# Altium schematic sheet TMP117 Temperature Sensors.SchDoc
size Letter
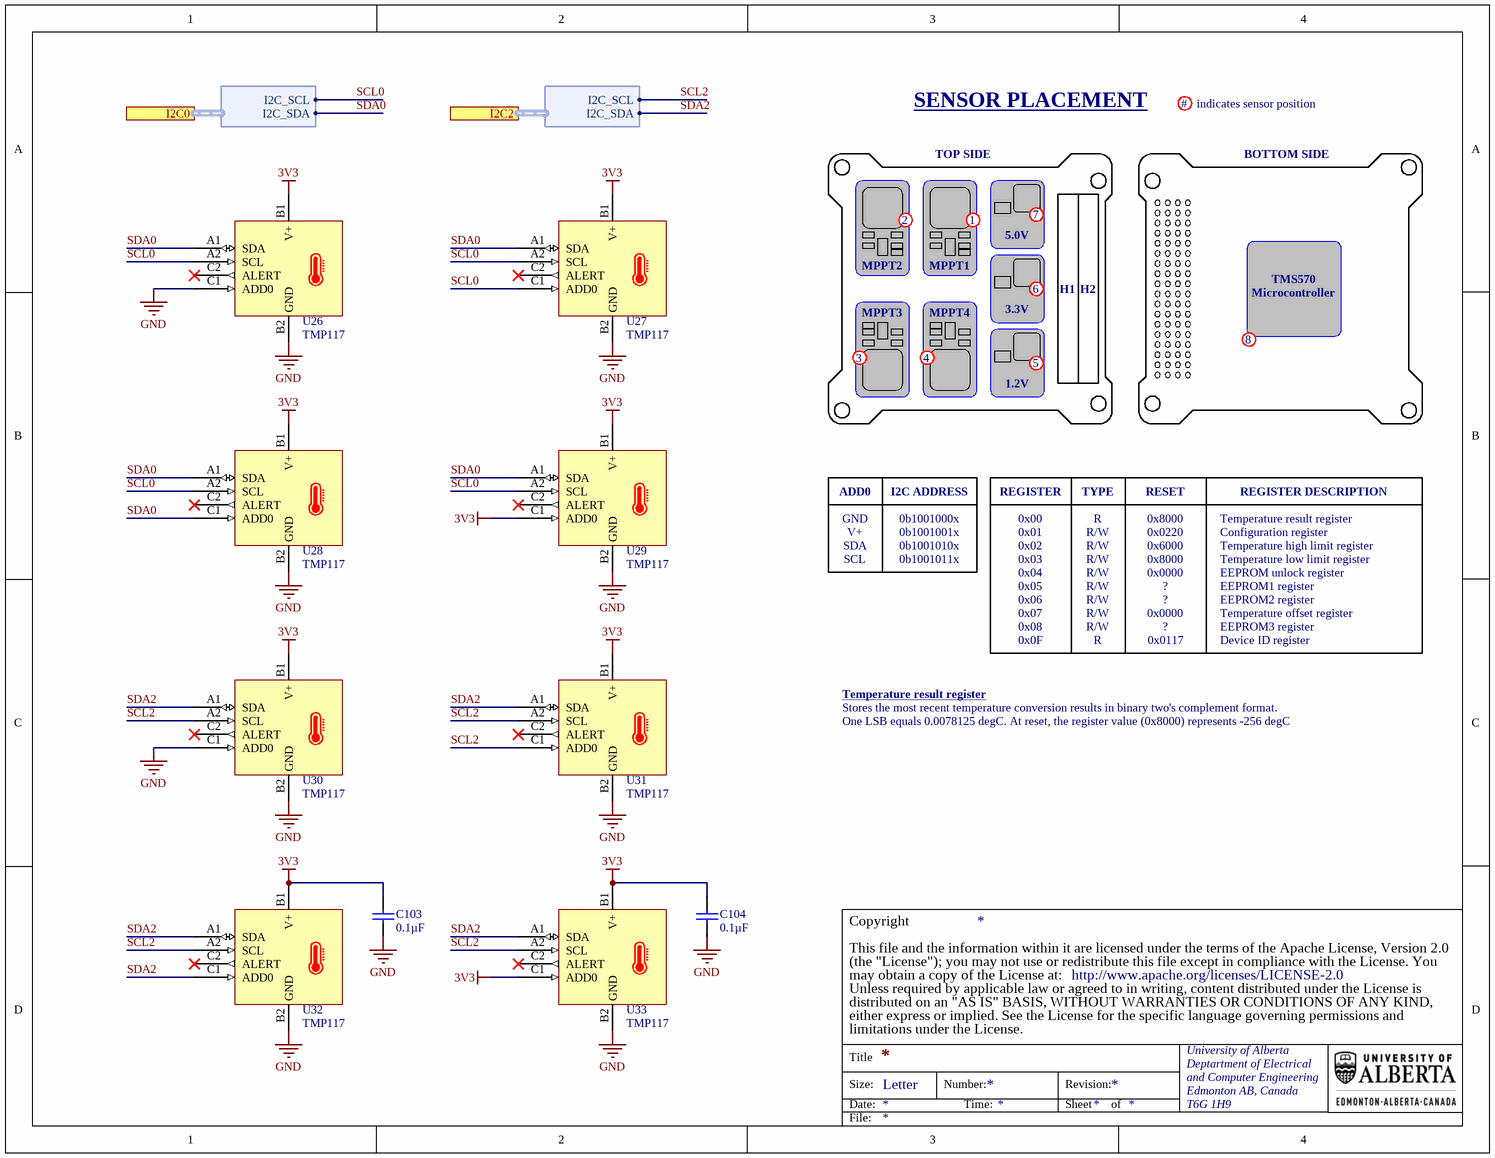
[diagram p0: TMP117 Temperature Sensors.SchDoc]

## Parts
C103  value 0.1µF  [TDK-CGA2B]  (hidden comment: Cap)
C104  value 0.1µF  [TDK-CGA2B]  (hidden comment: Cap)
U26  TMP117  [TI-YBG0006-C01]
U27  TMP117  [TI-YBG0006-C01]
U28  TMP117  [TI-YBG0006-C01]
U29  TMP117  [TI-YBG0006-C01]
U30  TMP117  [TI-YBG0006-C01]
U31  TMP117  [TI-YBG0006-C01]
U32  TMP117  [TI-YBG0006-C01]
U33  TMP117  [TI-YBG0006-C01]

## Ports
I2C0 (harness TCA9548A_I2CIN), I2C2 (harness TCA9548A_I2CIN)

## Harnesses
TCA9548A_I2CIN: I2C_SCL, I2C_SDA

## Nets
3V3: C103.1 C104.1 U26.B1(V+) U27.B1(V+) U28.B1(V+) U29.B1(V+) U29.C1(ADD0) U30.B1(V+) U31.B1(V+) U32.B1(V+) U33.B1(V+) U33.C1(ADD0)
GND: C103.2 C104.2 U26.B2(GND) U26.C1(ADD0) U27.B2(GND) U28.B2(GND) U29.B2(GND) U30.B2(GND) U30.C1(ADD0) U31.B2(GND) U32.B2(GND) U33.B2(GND)
SCL0: U26.A2(SCL) U27.A2(SCL) U27.C1(ADD0) U28.A2(SCL) U29.A2(SCL) ; port I2C0.I2C_SCL
SCL2: U30.A2(SCL) U31.A2(SCL) U31.C1(ADD0) U32.A2(SCL) U33.A2(SCL) ; port I2C2.I2C_SCL
SDA0: U26.A1(SDA) U27.A1(SDA) U28.A1(SDA) U28.C1(ADD0) U29.A1(SDA) ; port I2C0.I2C_SDA
SDA2: U30.A1(SDA) U31.A1(SDA) U32.A1(SDA) U32.C1(ADD0) U33.A1(SDA) ; port I2C2.I2C_SDA

Not connected (* = marked no-connect by the designer): U26 C2(ALERT)*; U27 C2(ALERT)*; U28 C2(ALERT)*; U29 C2(ALERT)*; U30 C2(ALERT)*; U31 C2(ALERT)*; U32 C2(ALERT)*; U33 C2(ALERT)*

## Notes on the sheet
- SENSOR PLACEMENT
- #
- indicates sensor position
- TOP SIDE
- BOTTOM SIDE
- 2
- 1
- 5.0V
- 7
- MPPT2
- MPPT1
- 6
- H1
- H2
- TMS570
- Microcontroller
- 3
- MPPT3
- 4
- MPPT4
- 3.3V
- 5
- 8
- 1.2V
- ADD0
- I2C ADDRESS
- REGISTER
- TYPE
- RESET
- REGISTER DESCRIPTION
- GND
- V+
- SDA
- SCL
- 0b1001000x
- 0b1001001x
- 0b1001010x
- 0b1001011x
- 0x00
- 0x01
- 0x02
- 0x03
- 0x04
- R
- R/W
- 0x8000
- 0x0220
- 0x6000
- 0x0000
- Temperature result register
- Configuration register
- Temperature high limit register
- Temperature low limit register
- EEPROM unlock register
- 0x05
- 0x06
- 0x07
- 0x08
- 0x0F
- ?
- 0x0117
- EEPROM2 register
- EEPROM1 register
- EEPROM3 register
- Temperature offset register
- Device ID register
- Stores the most recent temperature conversion results in binary two's complement format.
- One LSB equals 0.0078125 degC. At reset, the register value (0x8000) represents -256 degC
- (the "License"); you may not use or redistribute this file except in compliance with the License. You
- This file and the information within it are licensed under the terms of the Apache License, Version 2.0
- Copyright
- Unless required by applicable law or agreed to in writing, content distributed under the License is
- distributed on an "AS IS" BASIS, WITHOUT WARRANTIES OR CONDITIONS OF ANY KIND,
- either express or implied. See the License for the specific language governing permissions and
- limitations under the License.
- may obtain a copy of the License at:
- http://www.apache.org/licenses/LICENSE-2.0
- Title
- Size:
- Date:
- Letter
- Number:
- Time:
- Revision:
- Sheet
- of
- University of Alberta
- Deptartment of Electrical
- and Computer Engineering
- Edmonton AB, Canada
- T6G 1H9
- File:

## Library data of the parts
C103 C104 = PC-TDK-02259: CAP CER 0.1UF 50V X7R 0402; Manufacturer Part Number: CGA2B3X7R1H104K050BB; Index: 2259; Designator: C?; Tolerance: ±10%; Published: 2016-03-16; LatestRevisionDate: 2016-03-16; LatestRevisionNote: ...; PackageReference: 0402 (1005 Metric); Publisher: AlbertaSat; PackageDescription: Radial Cap, Thru-Hole; 2 Leads; 0.3 in Pin Spacing; Part Number: PC-TDK-02259; Supplier Part Number 1: 445-6899-1-ND; Supplier 1: Digi-key; Supplier Link: http://www.digikey.ca/product-search/en?keywords=445-6899-1-ND; Voltage - Rated: 50V; Temperature Coefficient: X7R; Applications: Automotive; Operating Temperature: -55°C ~ 125°C
U26-U33 = 164: Temperature Sensor Digital, Local -55°C ~ 150°C 16 b 6-DSBGA (1.49x0.95); Part Number: 164; Voltage - Supply: 1.8V ~ 5.5V; Accuracy - Highest (Lowest): ±0.2°C (±0.3°C); Designator: U?; Supplier Part Number 2: 595-TMP117NAIYBGR; Supplier 2: Mouser; Manufacturer Part Number: TMP117NAIYBGR; Supplier Part Number 1: 296-TMP117NAIYBGRCT-ND; Supplier 1: Digi-Key; Supplier Link: #https://www.digikey.com/en/products/detail/texas-instruments/TMP117NAIYBGR/10434700#; PackageReference: 6-DSBGA (1.49x0.95); Operating Temperature: -55°C ~ 150°C (TA); Sensing Temperature - Local: -55°C ~ 150°C